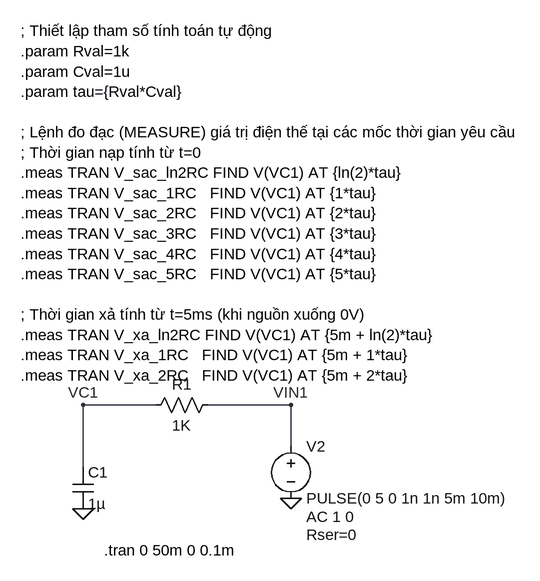
[diagram p0: schematic BAI 5 THUC HANH 1.asc]
BAI 5 THUC HANH 1.asc, the LTspice schematic file:
Version 4.1
SHEET 1 880 680
WIRE 112 144 0 144
WIRE 320 144 192 144
WIRE 320 208 320 144
WIRE 0 240 0 144
FLAG 320 144 VIN1
FLAG 320 288 0
FLAG 0 144 VC1
FLAG 0 304 0
SYMBOL res 208 128 R90
WINDOW 0 0 56 VBottom 2
WINDOW 3 32 56 VTop 2
SYMATTR InstName R1
SYMATTR Value 1K
SYMBOL voltage 320 192 R0
WINDOW 123 24 124 Left 2
WINDOW 39 24 152 Left 2
SYMATTR Value2 AC 1 0
SYMATTR SpiceLine Rser=0
SYMATTR InstName V2
SYMATTR Value PULSE(0 5 0 1n 1n 5m 10m)
SYMBOL cap -16 240 R0
SYMATTR InstName C1
SYMATTR Value 1µ
TEXT 32 368 Left 2 !.tran 0 50m 0 0.1m
TEXT -96 -432 Left 2 !; Thiết lập tham số tính toán tự động\n.param Rval=1k\n.param Cval=1u\n.param tau={Rval*Cval}\n \n; Lệnh đo đạc (MEASURE) giá trị điện thế tại các mốc thời gian yêu cầu\n; Thời gian nạp tính từ t=0\n.meas TRAN V_sac_ln2RC FIND V(VC1) AT {ln(2)*tau}\n.meas TRAN V_sac_1RC   FIND V(VC1) AT {1*tau}\n.meas TRAN V_sac_2RC   FIND V(VC1) AT {2*tau}\n.meas TRAN V_sac_3RC   FIND V(VC1) AT {3*tau}\n.meas TRAN V_sac_4RC   FIND V(VC1) AT {4*tau}\n.meas TRAN V_sac_5RC   FIND V(VC1) AT {5*tau}\n \n; Thời gian xả tính từ t=5ms (khi nguồn xuống 0V)\n.meas TRAN V_xa_ln2RC FIND V(VC1) AT {5m + ln(2)*tau}\n.meas TRAN V_xa_1RC   FIND V(VC1) AT {5m + 1*tau}\n.meas TRAN V_xa_2RC   FIND V(VC1) AT {5m + 2*tau}

The netlist it stands for:
* BAI 5 THUC HANH 1.asc
R1 VIN1 VC1 1K
V2 VIN1 0 PULSE(0 5 0 1n 1n 5m 10m) AC 1 0 Rser=0
C1 VC1 0 1µ
.tran 0 50m 0 0.1m
; Thiết lập tham số tính toán tự động
.param Rval=1k
.param Cval=1u
.param tau={Rval*Cval}
; Lệnh đo đạc (MEASURE) giá trị điện thế tại các mốc thời gian yêu cầu
; Thời gian nạp tính từ t=0
.meas TRAN V_sac_ln2RC FIND V(VC1) AT {ln(2)*tau}
.meas TRAN V_sac_1RC   FIND V(VC1) AT {1*tau}
.meas TRAN V_sac_2RC   FIND V(VC1) AT {2*tau}
.meas TRAN V_sac_3RC   FIND V(VC1) AT {3*tau}
.meas TRAN V_sac_4RC   FIND V(VC1) AT {4*tau}
.meas TRAN V_sac_5RC   FIND V(VC1) AT {5*tau}
; Thời gian xả tính từ t=5ms (khi nguồn xuống 0V)
.meas TRAN V_xa_ln2RC FIND V(VC1) AT {5m + ln(2)*tau}
.meas TRAN V_xa_1RC   FIND V(VC1) AT {5m + 1*tau}
.meas TRAN V_xa_2RC   FIND V(VC1) AT {5m + 2*tau}
.backanno
.end

* Results of the author's LTspice run, read from the files saved beside the schematic
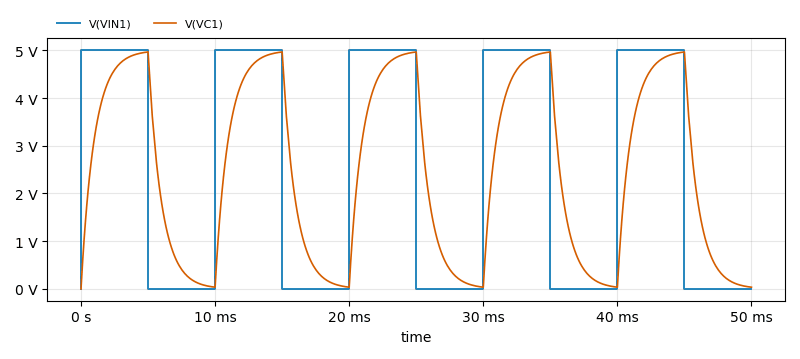
[diagram p1: Transient Analysis of BAI 5 THUC HANH 1.asc, plotted from the saved traces]
* Transient Analysis, 1 run:
*   V(VIN1): min 0 V, max 5 V, average 2.5 V, rms 3.536 V, last 0 V
*   V(VC1): min 0 V, max 4.967 V, average 2.501 V, rms 3.172 V, last 33.33 mV
* From the log:
*   v_sac_ln2rc: V(VC1)=2.49826882199 at 0.00069314718056
*   v_sac_1rc: V(VC1)=3.15998849488 at 0.001
*   v_sac_2rc: V(VC1)=4.32366211956 at 0.002
*   v_sac_3rc: V(VC1)=4.75139699923 at 0.003
*   v_sac_4rc: V(VC1)=4.90862021778 at 0.004
*   v_sac_5rc: V(VC1)=4.96644684177 at 0.005
*   v_xa_ln2rc: V(VC1)=2.48494630129 at 0.00569314718056
*   v_xa_1rc: V(VC1)=1.8276661266 at 0.006
*   v_xa_2rc: V(VC1)=0.671799861575 at 0.007